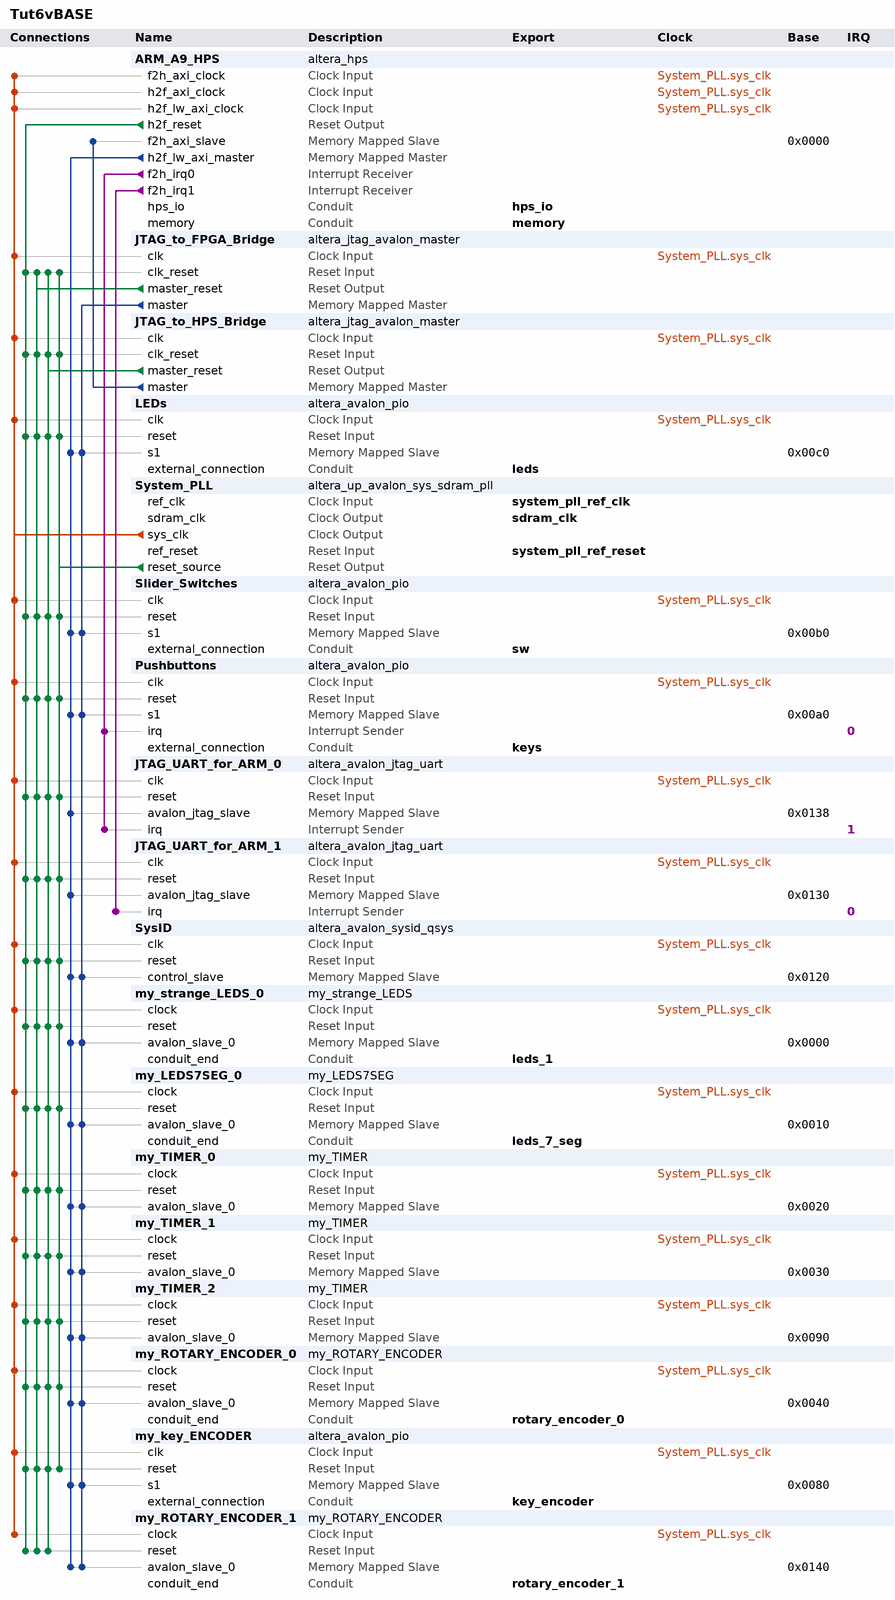
[diagram p0: system contents]
# Platform Designer (Qsys) system Tut6vBASE, Cyclone V 5CSEMA5F31C6
# Parameters at their usual value, and those the tool derives, are not listed.
package require -exact qsys 22.1
create_system Tut6vBASE
set_project_property DEVICE_FAMILY {Cyclone V}
set_project_property DEVICE 5CSEMA5F31C6

add_instance ARM_A9_HPS altera_hps 22.1
set_instance_parameter_value ARM_A9_HPS EMAC1_Mode RGMII
set_instance_parameter_value ARM_A9_HPS EMAC1_PinMuxing {HPS I/O Set 0}
set_instance_parameter_value ARM_A9_HPS F2SCLK_COLDRST_Enable false
set_instance_parameter_value ARM_A9_HPS F2SCLK_DBGRST_Enable false
set_instance_parameter_value ARM_A9_HPS F2SCLK_WARMRST_Enable false
set_instance_parameter_value ARM_A9_HPS F2SINTERRUPT_Enable true
set_instance_parameter_value ARM_A9_HPS F2S_Width 2
set_instance_parameter_value ARM_A9_HPS FPGA_PERIPHERAL_OUTPUT_CLOCK_FREQ_EMAC0_GTX_CLK 100
set_instance_parameter_value ARM_A9_HPS FPGA_PERIPHERAL_OUTPUT_CLOCK_FREQ_EMAC0_MD_CLK 100.0
set_instance_parameter_value ARM_A9_HPS FPGA_PERIPHERAL_OUTPUT_CLOCK_FREQ_EMAC1_GTX_CLK 100
set_instance_parameter_value ARM_A9_HPS FPGA_PERIPHERAL_OUTPUT_CLOCK_FREQ_EMAC1_MD_CLK 100.0
set_instance_parameter_value ARM_A9_HPS HPS_PROTOCOL DDR3
set_instance_parameter_value ARM_A9_HPS I2C0_Mode I2C
set_instance_parameter_value ARM_A9_HPS I2C0_PinMuxing {HPS I/O Set 0}
set_instance_parameter_value ARM_A9_HPS I2C1_Mode I2C
set_instance_parameter_value ARM_A9_HPS I2C1_PinMuxing {HPS I/O Set 0}
set_instance_parameter_value ARM_A9_HPS LWH2F_Enable true
set_instance_parameter_value ARM_A9_HPS MEM_BANKADDR_WIDTH 3
set_instance_parameter_value ARM_A9_HPS MEM_CLK_FREQ 400.0
set_instance_parameter_value ARM_A9_HPS MEM_COL_ADDR_WIDTH 10
set_instance_parameter_value ARM_A9_HPS MEM_DQ_WIDTH 32
set_instance_parameter_value ARM_A9_HPS MEM_DRV_STR RZQ/6
set_instance_parameter_value ARM_A9_HPS MEM_ROW_ADDR_WIDTH 15
set_instance_parameter_value ARM_A9_HPS MEM_RTT_NOM RZQ/6
set_instance_parameter_value ARM_A9_HPS MEM_RTT_WR {Dynamic ODT off}
set_instance_parameter_value ARM_A9_HPS MEM_TCL 7
set_instance_parameter_value ARM_A9_HPS MEM_TFAW_NS 45.0
set_instance_parameter_value ARM_A9_HPS MEM_TRAS_NS 36.0
set_instance_parameter_value ARM_A9_HPS MEM_TRCD_NS 13.125
set_instance_parameter_value ARM_A9_HPS MEM_TRFC_NS 300.0
set_instance_parameter_value ARM_A9_HPS MEM_TRP_NS 13.125
set_instance_parameter_value ARM_A9_HPS MEM_VENDOR Micron
set_instance_parameter_value ARM_A9_HPS MEM_WTCL 7
set_instance_parameter_value ARM_A9_HPS QSPI_Mode {1 SS}
set_instance_parameter_value ARM_A9_HPS QSPI_PinMuxing {HPS I/O Set 0}
set_instance_parameter_value ARM_A9_HPS REF_CLK_FREQ 25.0
set_instance_parameter_value ARM_A9_HPS S2FCLK_USER2CLK 5
set_instance_parameter_value ARM_A9_HPS S2F_Width 3
set_instance_parameter_value ARM_A9_HPS SDIO_Mode {4-bit Data}
set_instance_parameter_value ARM_A9_HPS SDIO_PinMuxing {HPS I/O Set 0}
set_instance_parameter_value ARM_A9_HPS SPIM1_Mode {Single Slave Select}
set_instance_parameter_value ARM_A9_HPS SPIM1_PinMuxing {HPS I/O Set 0}
set_instance_parameter_value ARM_A9_HPS STM_Enable true
set_instance_parameter_value ARM_A9_HPS TIMING_BOARD_AC_SKEW 0.02
set_instance_parameter_value ARM_A9_HPS TIMING_BOARD_AC_TO_CK_SKEW 0.01
set_instance_parameter_value ARM_A9_HPS TIMING_BOARD_DQ_TO_DQS_SKEW 0.05
set_instance_parameter_value ARM_A9_HPS TIMING_BOARD_MAX_CK_DELAY 0.03
set_instance_parameter_value ARM_A9_HPS TIMING_BOARD_MAX_DQS_DELAY 0.02
set_instance_parameter_value ARM_A9_HPS TIMING_BOARD_SKEW_BETWEEN_DQS 0.06
set_instance_parameter_value ARM_A9_HPS TIMING_BOARD_SKEW_CKDQS_DIMM_MAX 0.12
set_instance_parameter_value ARM_A9_HPS TIMING_BOARD_SKEW_CKDQS_DIMM_MIN 0.06
set_instance_parameter_value ARM_A9_HPS TIMING_BOARD_SKEW_WITHIN_DQS 0.01
set_instance_parameter_value ARM_A9_HPS TIMING_TDH 65
set_instance_parameter_value ARM_A9_HPS TIMING_TDQSCK 255
set_instance_parameter_value ARM_A9_HPS TIMING_TDQSQ 125
set_instance_parameter_value ARM_A9_HPS TIMING_TDS 30
set_instance_parameter_value ARM_A9_HPS TIMING_TIH 140
set_instance_parameter_value ARM_A9_HPS TIMING_TIS 190
set_instance_parameter_value ARM_A9_HPS TIMING_TQSH 0.4
set_instance_parameter_value ARM_A9_HPS UART0_Mode {No Flow Control}
set_instance_parameter_value ARM_A9_HPS UART0_PinMuxing {HPS I/O Set 0}
set_instance_parameter_value ARM_A9_HPS USB1_Mode SDR
set_instance_parameter_value ARM_A9_HPS USB1_PinMuxing {HPS I/O Set 0}
set_instance_parameter_value ARM_A9_HPS desired_cfg_clk_mhz 100.0
set_instance_parameter_value ARM_A9_HPS desired_qspi_clk_mhz 400.0

add_instance JTAG_to_FPGA_Bridge altera_jtag_avalon_master 22.1

add_instance JTAG_to_HPS_Bridge altera_jtag_avalon_master 22.1

add_instance LEDs altera_avalon_pio 22.1
set_instance_parameter_value LEDs direction Output
set_instance_parameter_value LEDs width 10

add_instance System_PLL altera_up_avalon_sys_sdram_pll 18.0
set_instance_parameter_value System_PLL CV_boards DE1-SoC
set_instance_parameter_value System_PLL gui_outclk 100.0
set_instance_parameter_value System_PLL gui_refclk 50.0

add_instance Slider_Switches altera_avalon_pio 22.1
set_instance_parameter_value Slider_Switches direction Input
set_instance_parameter_value Slider_Switches simDoTestBenchWiring true
set_instance_parameter_value Slider_Switches width 10

add_instance Pushbuttons altera_avalon_pio 22.1
set_instance_parameter_value Pushbuttons bitClearingEdgeCapReg true
set_instance_parameter_value Pushbuttons captureEdge true
set_instance_parameter_value Pushbuttons direction Input
set_instance_parameter_value Pushbuttons edgeType FALLING
set_instance_parameter_value Pushbuttons generateIRQ true
set_instance_parameter_value Pushbuttons irqType EDGE
set_instance_parameter_value Pushbuttons simDoTestBenchWiring true
set_instance_parameter_value Pushbuttons width 4

add_instance JTAG_UART_for_ARM_0 altera_avalon_jtag_uart 22.1
set_instance_parameter_value JTAG_UART_for_ARM_0 simInteractiveOptions NO_INTERACTIVE_WINDOWS

add_instance JTAG_UART_for_ARM_1 altera_avalon_jtag_uart 22.1
set_instance_parameter_value JTAG_UART_for_ARM_1 simInteractiveOptions NO_INTERACTIVE_WINDOWS

add_instance SysID altera_avalon_sysid_qsys 22.1
set_instance_parameter_value SysID id 0

add_instance my_strange_LEDS_0 my_strange_LEDS 1.0

add_instance my_LEDS7SEG_0 my_LEDS7SEG 1.0

add_instance my_TIMER_0 my_TIMER 1.0
set_instance_parameter_value my_TIMER_0 ADDR_WIDTH 2
set_instance_parameter_value my_TIMER_0 DATA_WIDTH 32
set_instance_parameter_value my_TIMER_0 SUBSAMP 100000000

add_instance my_TIMER_1 my_TIMER 1.0
set_instance_parameter_value my_TIMER_1 ADDR_WIDTH 2
set_instance_parameter_value my_TIMER_1 DATA_WIDTH 32
set_instance_parameter_value my_TIMER_1 SUBSAMP 50000000

add_instance my_TIMER_2 my_TIMER 1.0
set_instance_parameter_value my_TIMER_2 ADDR_WIDTH 2
set_instance_parameter_value my_TIMER_2 DATA_WIDTH 32
set_instance_parameter_value my_TIMER_2 SUBSAMP 1000000

add_instance my_ROTARY_ENCODER_0 my_ROTARY_ENCODER 1.0
set_instance_parameter_value my_ROTARY_ENCODER_0 ADDR_WIDTH 4
set_instance_parameter_value my_ROTARY_ENCODER_0 DATA_WIDTH 32
set_instance_parameter_value my_ROTARY_ENCODER_0 SUBSAMP 12

add_instance my_key_ENCODER altera_avalon_pio 22.1
set_instance_parameter_value my_key_ENCODER direction Input
set_instance_parameter_value my_key_ENCODER width 1

add_instance my_ROTARY_ENCODER_1 my_ROTARY_ENCODER 1.0
set_instance_parameter_value my_ROTARY_ENCODER_1 ADDR_WIDTH 4
set_instance_parameter_value my_ROTARY_ENCODER_1 DATA_WIDTH 32
set_instance_parameter_value my_ROTARY_ENCODER_1 SUBSAMP 12

# connections
add_connection System_PLL.sys_clk ARM_A9_HPS.f2h_axi_clock clock
add_connection System_PLL.sys_clk ARM_A9_HPS.h2f_axi_clock clock
add_connection System_PLL.sys_clk ARM_A9_HPS.h2f_lw_axi_clock clock
add_connection System_PLL.sys_clk JTAG_to_FPGA_Bridge.clk clock
add_connection System_PLL.sys_clk JTAG_to_HPS_Bridge.clk clock
add_connection System_PLL.sys_clk JTAG_UART_for_ARM_0.clk clock
add_connection System_PLL.sys_clk JTAG_UART_for_ARM_1.clk clock
add_connection System_PLL.sys_clk LEDs.clk clock
add_connection System_PLL.sys_clk my_key_ENCODER.clk clock
add_connection System_PLL.sys_clk my_LEDS7SEG_0.clock clock
add_connection System_PLL.sys_clk my_ROTARY_ENCODER_0.clock clock
add_connection System_PLL.sys_clk my_ROTARY_ENCODER_1.clock clock
add_connection System_PLL.sys_clk my_strange_LEDS_0.clock clock
add_connection System_PLL.sys_clk my_TIMER_0.clock clock
add_connection System_PLL.sys_clk my_TIMER_1.clock clock
add_connection System_PLL.sys_clk my_TIMER_2.clock clock
add_connection System_PLL.sys_clk Pushbuttons.clk clock
add_connection System_PLL.sys_clk Slider_Switches.clk clock
add_connection System_PLL.sys_clk SysID.clk clock
add_connection ARM_A9_HPS.h2f_reset JTAG_to_FPGA_Bridge.clk_reset reset
add_connection ARM_A9_HPS.h2f_reset JTAG_to_HPS_Bridge.clk_reset reset
add_connection ARM_A9_HPS.h2f_reset JTAG_UART_for_ARM_0.reset reset
add_connection ARM_A9_HPS.h2f_reset JTAG_UART_for_ARM_1.reset reset
add_connection ARM_A9_HPS.h2f_reset LEDs.reset reset
add_connection ARM_A9_HPS.h2f_reset my_key_ENCODER.reset reset
add_connection ARM_A9_HPS.h2f_reset my_LEDS7SEG_0.reset reset
add_connection ARM_A9_HPS.h2f_reset my_ROTARY_ENCODER_0.reset reset
add_connection ARM_A9_HPS.h2f_reset my_ROTARY_ENCODER_1.reset reset
add_connection ARM_A9_HPS.h2f_reset my_strange_LEDS_0.reset reset
add_connection ARM_A9_HPS.h2f_reset my_TIMER_0.reset reset
add_connection ARM_A9_HPS.h2f_reset my_TIMER_1.reset reset
add_connection ARM_A9_HPS.h2f_reset my_TIMER_2.reset reset
add_connection ARM_A9_HPS.h2f_reset Pushbuttons.reset reset
add_connection ARM_A9_HPS.h2f_reset Slider_Switches.reset reset
add_connection ARM_A9_HPS.h2f_reset SysID.reset reset
add_connection JTAG_to_FPGA_Bridge.master_reset JTAG_to_FPGA_Bridge.clk_reset reset
add_connection JTAG_to_FPGA_Bridge.master_reset JTAG_to_HPS_Bridge.clk_reset reset
add_connection JTAG_to_FPGA_Bridge.master_reset JTAG_UART_for_ARM_0.reset reset
add_connection JTAG_to_FPGA_Bridge.master_reset JTAG_UART_for_ARM_1.reset reset
add_connection JTAG_to_FPGA_Bridge.master_reset LEDs.reset reset
add_connection JTAG_to_FPGA_Bridge.master_reset my_key_ENCODER.reset reset
add_connection JTAG_to_FPGA_Bridge.master_reset my_LEDS7SEG_0.reset reset
add_connection JTAG_to_FPGA_Bridge.master_reset my_ROTARY_ENCODER_0.reset reset
add_connection JTAG_to_FPGA_Bridge.master_reset my_ROTARY_ENCODER_1.reset reset
add_connection JTAG_to_FPGA_Bridge.master_reset my_strange_LEDS_0.reset reset
add_connection JTAG_to_FPGA_Bridge.master_reset my_TIMER_0.reset reset
add_connection JTAG_to_FPGA_Bridge.master_reset my_TIMER_1.reset reset
add_connection JTAG_to_FPGA_Bridge.master_reset my_TIMER_2.reset reset
add_connection JTAG_to_FPGA_Bridge.master_reset Pushbuttons.reset reset
add_connection JTAG_to_FPGA_Bridge.master_reset Slider_Switches.reset reset
add_connection JTAG_to_FPGA_Bridge.master_reset SysID.reset reset
add_connection JTAG_to_HPS_Bridge.master_reset JTAG_to_FPGA_Bridge.clk_reset reset
add_connection JTAG_to_HPS_Bridge.master_reset JTAG_to_HPS_Bridge.clk_reset reset
add_connection JTAG_to_HPS_Bridge.master_reset JTAG_UART_for_ARM_0.reset reset
add_connection JTAG_to_HPS_Bridge.master_reset JTAG_UART_for_ARM_1.reset reset
add_connection JTAG_to_HPS_Bridge.master_reset LEDs.reset reset
add_connection JTAG_to_HPS_Bridge.master_reset my_key_ENCODER.reset reset
add_connection JTAG_to_HPS_Bridge.master_reset my_LEDS7SEG_0.reset reset
add_connection JTAG_to_HPS_Bridge.master_reset my_ROTARY_ENCODER_0.reset reset
add_connection JTAG_to_HPS_Bridge.master_reset my_ROTARY_ENCODER_1.reset reset
add_connection JTAG_to_HPS_Bridge.master_reset my_strange_LEDS_0.reset reset
add_connection JTAG_to_HPS_Bridge.master_reset my_TIMER_0.reset reset
add_connection JTAG_to_HPS_Bridge.master_reset my_TIMER_1.reset reset
add_connection JTAG_to_HPS_Bridge.master_reset my_TIMER_2.reset reset
add_connection JTAG_to_HPS_Bridge.master_reset Pushbuttons.reset reset
add_connection JTAG_to_HPS_Bridge.master_reset Slider_Switches.reset reset
add_connection JTAG_to_HPS_Bridge.master_reset SysID.reset reset
add_connection System_PLL.reset_source JTAG_to_FPGA_Bridge.clk_reset reset
add_connection System_PLL.reset_source JTAG_to_HPS_Bridge.clk_reset reset
add_connection System_PLL.reset_source JTAG_UART_for_ARM_0.reset reset
add_connection System_PLL.reset_source JTAG_UART_for_ARM_1.reset reset
add_connection System_PLL.reset_source LEDs.reset reset
add_connection System_PLL.reset_source my_key_ENCODER.reset reset
add_connection System_PLL.reset_source my_LEDS7SEG_0.reset reset
add_connection System_PLL.reset_source my_ROTARY_ENCODER_0.reset reset
add_connection System_PLL.reset_source my_strange_LEDS_0.reset reset
add_connection System_PLL.reset_source my_TIMER_0.reset reset
add_connection System_PLL.reset_source my_TIMER_1.reset reset
add_connection System_PLL.reset_source my_TIMER_2.reset reset
add_connection System_PLL.reset_source Pushbuttons.reset reset
add_connection System_PLL.reset_source Slider_Switches.reset reset
add_connection System_PLL.reset_source SysID.reset reset
add_connection ARM_A9_HPS.h2f_lw_axi_master JTAG_UART_for_ARM_0.avalon_jtag_slave avalon
set_connection_parameter_value ARM_A9_HPS.h2f_lw_axi_master/JTAG_UART_for_ARM_0.avalon_jtag_slave baseAddress 0x0138
add_connection ARM_A9_HPS.h2f_lw_axi_master JTAG_UART_for_ARM_1.avalon_jtag_slave avalon
set_connection_parameter_value ARM_A9_HPS.h2f_lw_axi_master/JTAG_UART_for_ARM_1.avalon_jtag_slave baseAddress 0x0130
add_connection ARM_A9_HPS.h2f_lw_axi_master LEDs.s1 avalon
set_connection_parameter_value ARM_A9_HPS.h2f_lw_axi_master/LEDs.s1 baseAddress 0x00c0
add_connection ARM_A9_HPS.h2f_lw_axi_master my_key_ENCODER.s1 avalon
set_connection_parameter_value ARM_A9_HPS.h2f_lw_axi_master/my_key_ENCODER.s1 baseAddress 0x0080
add_connection ARM_A9_HPS.h2f_lw_axi_master my_LEDS7SEG_0.avalon_slave_0 avalon
set_connection_parameter_value ARM_A9_HPS.h2f_lw_axi_master/my_LEDS7SEG_0.avalon_slave_0 baseAddress 0x0010
add_connection ARM_A9_HPS.h2f_lw_axi_master my_ROTARY_ENCODER_0.avalon_slave_0 avalon
set_connection_parameter_value ARM_A9_HPS.h2f_lw_axi_master/my_ROTARY_ENCODER_0.avalon_slave_0 baseAddress 0x0040
add_connection ARM_A9_HPS.h2f_lw_axi_master my_ROTARY_ENCODER_1.avalon_slave_0 avalon
set_connection_parameter_value ARM_A9_HPS.h2f_lw_axi_master/my_ROTARY_ENCODER_1.avalon_slave_0 baseAddress 0x0140
add_connection ARM_A9_HPS.h2f_lw_axi_master my_strange_LEDS_0.avalon_slave_0 avalon
set_connection_parameter_value ARM_A9_HPS.h2f_lw_axi_master/my_strange_LEDS_0.avalon_slave_0 baseAddress 0x0000
add_connection ARM_A9_HPS.h2f_lw_axi_master my_TIMER_0.avalon_slave_0 avalon
set_connection_parameter_value ARM_A9_HPS.h2f_lw_axi_master/my_TIMER_0.avalon_slave_0 baseAddress 0x0020
add_connection ARM_A9_HPS.h2f_lw_axi_master my_TIMER_1.avalon_slave_0 avalon
set_connection_parameter_value ARM_A9_HPS.h2f_lw_axi_master/my_TIMER_1.avalon_slave_0 baseAddress 0x0030
add_connection ARM_A9_HPS.h2f_lw_axi_master my_TIMER_2.avalon_slave_0 avalon
set_connection_parameter_value ARM_A9_HPS.h2f_lw_axi_master/my_TIMER_2.avalon_slave_0 baseAddress 0x0090
add_connection ARM_A9_HPS.h2f_lw_axi_master Pushbuttons.s1 avalon
set_connection_parameter_value ARM_A9_HPS.h2f_lw_axi_master/Pushbuttons.s1 baseAddress 0x00a0
add_connection ARM_A9_HPS.h2f_lw_axi_master Slider_Switches.s1 avalon
set_connection_parameter_value ARM_A9_HPS.h2f_lw_axi_master/Slider_Switches.s1 baseAddress 0x00b0
add_connection ARM_A9_HPS.h2f_lw_axi_master SysID.control_slave avalon
set_connection_parameter_value ARM_A9_HPS.h2f_lw_axi_master/SysID.control_slave baseAddress 0x0120
add_connection JTAG_to_FPGA_Bridge.master LEDs.s1 avalon
set_connection_parameter_value JTAG_to_FPGA_Bridge.master/LEDs.s1 baseAddress 0x00c0
add_connection JTAG_to_FPGA_Bridge.master my_key_ENCODER.s1 avalon
set_connection_parameter_value JTAG_to_FPGA_Bridge.master/my_key_ENCODER.s1 baseAddress 0x0080
add_connection JTAG_to_FPGA_Bridge.master my_LEDS7SEG_0.avalon_slave_0 avalon
set_connection_parameter_value JTAG_to_FPGA_Bridge.master/my_LEDS7SEG_0.avalon_slave_0 baseAddress 0x0010
add_connection JTAG_to_FPGA_Bridge.master my_ROTARY_ENCODER_0.avalon_slave_0 avalon
set_connection_parameter_value JTAG_to_FPGA_Bridge.master/my_ROTARY_ENCODER_0.avalon_slave_0 baseAddress 0x0040
add_connection JTAG_to_FPGA_Bridge.master my_ROTARY_ENCODER_1.avalon_slave_0 avalon
set_connection_parameter_value JTAG_to_FPGA_Bridge.master/my_ROTARY_ENCODER_1.avalon_slave_0 baseAddress 0x0140
add_connection JTAG_to_FPGA_Bridge.master my_strange_LEDS_0.avalon_slave_0 avalon
set_connection_parameter_value JTAG_to_FPGA_Bridge.master/my_strange_LEDS_0.avalon_slave_0 baseAddress 0x0000
add_connection JTAG_to_FPGA_Bridge.master my_TIMER_0.avalon_slave_0 avalon
set_connection_parameter_value JTAG_to_FPGA_Bridge.master/my_TIMER_0.avalon_slave_0 baseAddress 0x0020
add_connection JTAG_to_FPGA_Bridge.master my_TIMER_1.avalon_slave_0 avalon
set_connection_parameter_value JTAG_to_FPGA_Bridge.master/my_TIMER_1.avalon_slave_0 baseAddress 0x0030
add_connection JTAG_to_FPGA_Bridge.master my_TIMER_2.avalon_slave_0 avalon
set_connection_parameter_value JTAG_to_FPGA_Bridge.master/my_TIMER_2.avalon_slave_0 baseAddress 0x0090
add_connection JTAG_to_FPGA_Bridge.master Pushbuttons.s1 avalon
set_connection_parameter_value JTAG_to_FPGA_Bridge.master/Pushbuttons.s1 baseAddress 0x00a0
add_connection JTAG_to_FPGA_Bridge.master Slider_Switches.s1 avalon
set_connection_parameter_value JTAG_to_FPGA_Bridge.master/Slider_Switches.s1 baseAddress 0x00b0
add_connection JTAG_to_FPGA_Bridge.master SysID.control_slave avalon
set_connection_parameter_value JTAG_to_FPGA_Bridge.master/SysID.control_slave baseAddress 0x0120
add_connection JTAG_to_HPS_Bridge.master ARM_A9_HPS.f2h_axi_slave avalon
set_connection_parameter_value JTAG_to_HPS_Bridge.master/ARM_A9_HPS.f2h_axi_slave baseAddress 0x0000
add_connection ARM_A9_HPS.f2h_irq0 JTAG_UART_for_ARM_0.irq interrupt
set_connection_parameter_value ARM_A9_HPS.f2h_irq0/JTAG_UART_for_ARM_0.irq irqNumber 1
add_connection ARM_A9_HPS.f2h_irq0 Pushbuttons.irq interrupt
set_connection_parameter_value ARM_A9_HPS.f2h_irq0/Pushbuttons.irq irqNumber 0
add_connection ARM_A9_HPS.f2h_irq1 JTAG_UART_for_ARM_1.irq interrupt
set_connection_parameter_value ARM_A9_HPS.f2h_irq1/JTAG_UART_for_ARM_1.irq irqNumber 0

# exported interfaces
add_interface hps_io conduit end
set_interface_property hps_io EXPORT_OF ARM_A9_HPS.hps_io
add_interface key_encoder conduit end
set_interface_property key_encoder EXPORT_OF my_key_ENCODER.external_connection
add_interface keys conduit end
set_interface_property keys EXPORT_OF Pushbuttons.external_connection
add_interface leds conduit end
set_interface_property leds EXPORT_OF LEDs.external_connection
add_interface leds_1 conduit end
set_interface_property leds_1 EXPORT_OF my_strange_LEDS_0.conduit_end
add_interface leds_7_seg conduit end
set_interface_property leds_7_seg EXPORT_OF my_LEDS7SEG_0.conduit_end
add_interface memory conduit end
set_interface_property memory EXPORT_OF ARM_A9_HPS.memory
add_interface rotary_encoder_0 conduit end
set_interface_property rotary_encoder_0 EXPORT_OF my_ROTARY_ENCODER_0.conduit_end
add_interface rotary_encoder_1 conduit end
set_interface_property rotary_encoder_1 EXPORT_OF my_ROTARY_ENCODER_1.conduit_end
add_interface sdram_clk clock source
set_interface_property sdram_clk EXPORT_OF System_PLL.sdram_clk
add_interface sw conduit end
set_interface_property sw EXPORT_OF Slider_Switches.external_connection
add_interface system_pll_ref_clk clock sink
set_interface_property system_pll_ref_clk EXPORT_OF System_PLL.ref_clk
add_interface system_pll_ref_reset reset sink
set_interface_property system_pll_ref_reset EXPORT_OF System_PLL.ref_reset

set_interconnect_requirement {$system} qsys_mm.clockCrossingAdapter HANDSHAKE
set_interconnect_requirement {$system} qsys_mm.enableEccProtection FALSE
set_interconnect_requirement {$system} qsys_mm.insertDefaultSlave FALSE
set_interconnect_requirement {$system} qsys_mm.maxAdditionalLatency 1

save_system Tut6vBASE.qsys
